# Altium schematic sheet DE_TMP_BAS_DTON.SchDoc
size A
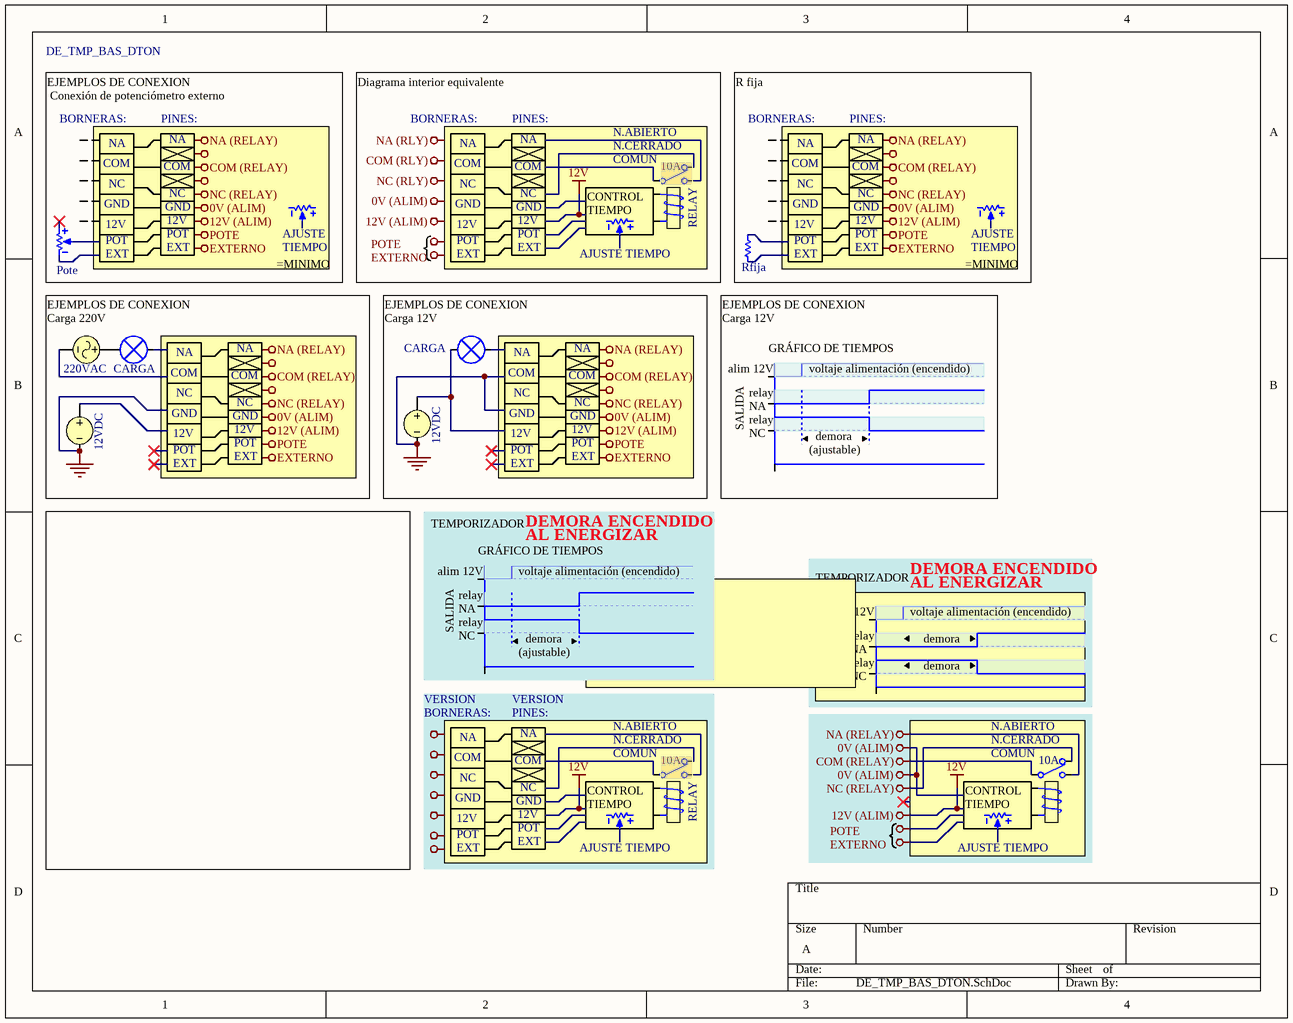
[diagram p0: DE_TMP_BAS_DTON.SchDoc]

## Parts
(Parts that share a designator on the sheet are numbered #1, #2 ... from top to bottom, then left to right.)
CARGA#1  Lamp  [bornera2]  (value not drawn)
CARGA#2  Lamp  [bornera2]  (value not drawn)
K?#1  Relay2  [RELAY2]  (value not drawn)
K?#2  Relay2  [RELAY2]  (value not drawn)
K?#3  Relay2  [RELAY2]  (value not drawn)
R?#1  Set Position: AJUSTE  [conpol4x1]  (hidden comment: RVar)  (part A of 2)
R?#2  Set Position: AJUSTE  [conpol4x1]  (hidden comment: RVar)  (part A of 2)
R?#3  value Pote  [PRESET6]  (hidden comment: Preset)
R?#4  Set Position: AJUSTE TIEMPO  [conpol4x1]  (hidden comment: RVar)  (part A of 2)
R?#5  Set Position: AJUSTE TIEMPO  [conpol4x1]  (hidden comment: RVar)  (part A of 2)
R?#6  Set Position: AJUSTE TIEMPO  [conpol4x1]  (hidden comment: RVar)  (part A of 2)
Rfija  Resistencia 1Kohm 10W  [R_10W]  (value not drawn)
V?#1  220VAC
V?#2  12VDC
V?#3  12VDC

## Nets
COM (RELAY): K?#3.1
NA (RELAY): K?#3.3
NC (RELAY): K?#3.2
NetCARGA#1_1: CARGA#1.1 V?#1.1
NetCARGA#2_1: CARGA#2.1 V?#2.1

Not connected (* = marked no-connect by the designer): CARGA#1 2; CARGA#2 2; K?#1 1 2 3 4 5; K?#2 1 2 3 4 5; K?#3 4 5; R?#1 1 2 3; R?#2 1 2 3; R?#3 1* 2 3; R?#4 1 2 3; R?#5 1 2 3; R?#6 1 2 3; Rfija 1 2; V?#1 2; V?#2 2; V?#3 1 2

## Notes on the sheet
- DE_TMP_BAS_DTON
- BORNERAS:
- COM
- NA
- PINES:
- (near K?#1) N.ABIERTO
- (near K?#1) N.CERRADO
- (near K?#1) COMUN
- (near R?#3) GND
- (near R?#3) 12V
- (near R?#3) NC
- GND
- 12V
- POT
- NC
- (near R?#4) CONTROL TIEMPO
- (near K?#1) 10A
- (near K?#1) RELAY
- (near Rfija) GND
- (near Rfija) 12V
- (near R?#3) EJEMPLOS DE CONEXION
  Conexión de potenciómetro externo
- (near R?#3) POT
- (near R?#3) EXT
- EXT
- Diagrama interior equivalente
- POTE EXTERNO
- R fija
- (near Rfija) POT
- (near Rfija) EXT
- (near CARGA#1) NA
- (near CARGA#2) NA
- alim 12V
- GRÁFICO DE TIEMPOS
- voltaje alimentación (encendido)
- (near CARGA#1) COM
- (near CARGA#1) NC
- (near CARGA#2) COM
- (near CARGA#2) NC
- relay
  NA
- relay
  NC
- SALIDA
- (near V?#1) EJEMPLOS DE CONEXION
  Carga 220V
- EJEMPLOS DE CONEXION
  Carga 12V
- (near Rfija) EJEMPLOS DE CONEXION
  Carga 12V
- (ajustable)
- demora
- TEMPORIZADOR
- DEMORA ENCENDIDO
- AL ENERGIZAR
- VERSION
- (near K?#2) N.ABIERTO
- (near K?#2) N.CERRADO
- (near K?#2) COMUN
- (near K?#2) 10A
- (near K?#3) N.ABIERTO
- (near K?#3) N.CERRADO
- (near K?#3) COMUN
- (near K?#3) 10A
- (near R?#5) CONTROL TIEMPO
- (near K?#2) RELAY
- (near R?#6) CONTROL TIEMPO
- Labels drawn without touching a wire or pin: 0V (ALIM), 12V (ALIM), COM (RELAY), COM (RLY), EXTERNO, NA (RELAY), NA (RLY), NC (RELAY), NC (RLY), POTE
- (in symbol RVar, part A) TIEMPO

## Library data of the parts
CARGA#1 CARGA#2 = Lamp: Indicator; Price: ?
K?#1-K?#3 = Relay2: Relay; Price: ?; Current: ?
R?#1 R?#2 = RVar: Resistencia Variable
R?#3 = Preset: Resistencia Variable
R?#4-R?#6 = RVar: Resistencia Variable; Value: 1K
Rfija = Resistencia 1Kohm 10W: Codigo Elemon: RS3886185; Dolares Elemon: 0.00720; Resistencia: 1K
V?#1 = VSIN: Sinusoidal Voltage Source; Note: PCB Footprint - Not required; Published: 8-Jun-2000; LatestRevisionDate: 15-Nov-2004; LatestRevisionNote: Corrected Netlist.; PackageReference: Not Applicable; Publisher: Altium Limited
V?#2 V?#3 = VSRC: Voltage Source; Note: PCB Footprint - Not required; Published: 8-Jun-2000; LatestRevisionDate: 17-Jul-2002; LatestRevisionNote: Re-released for DXP Platform.; PackageReference: Not Applicable; Publisher: Altium Limited